# Altium schematic sheet bmsMaster_usb.SchDoc
size A; SheetNumber: 4; SheetTotal: 7
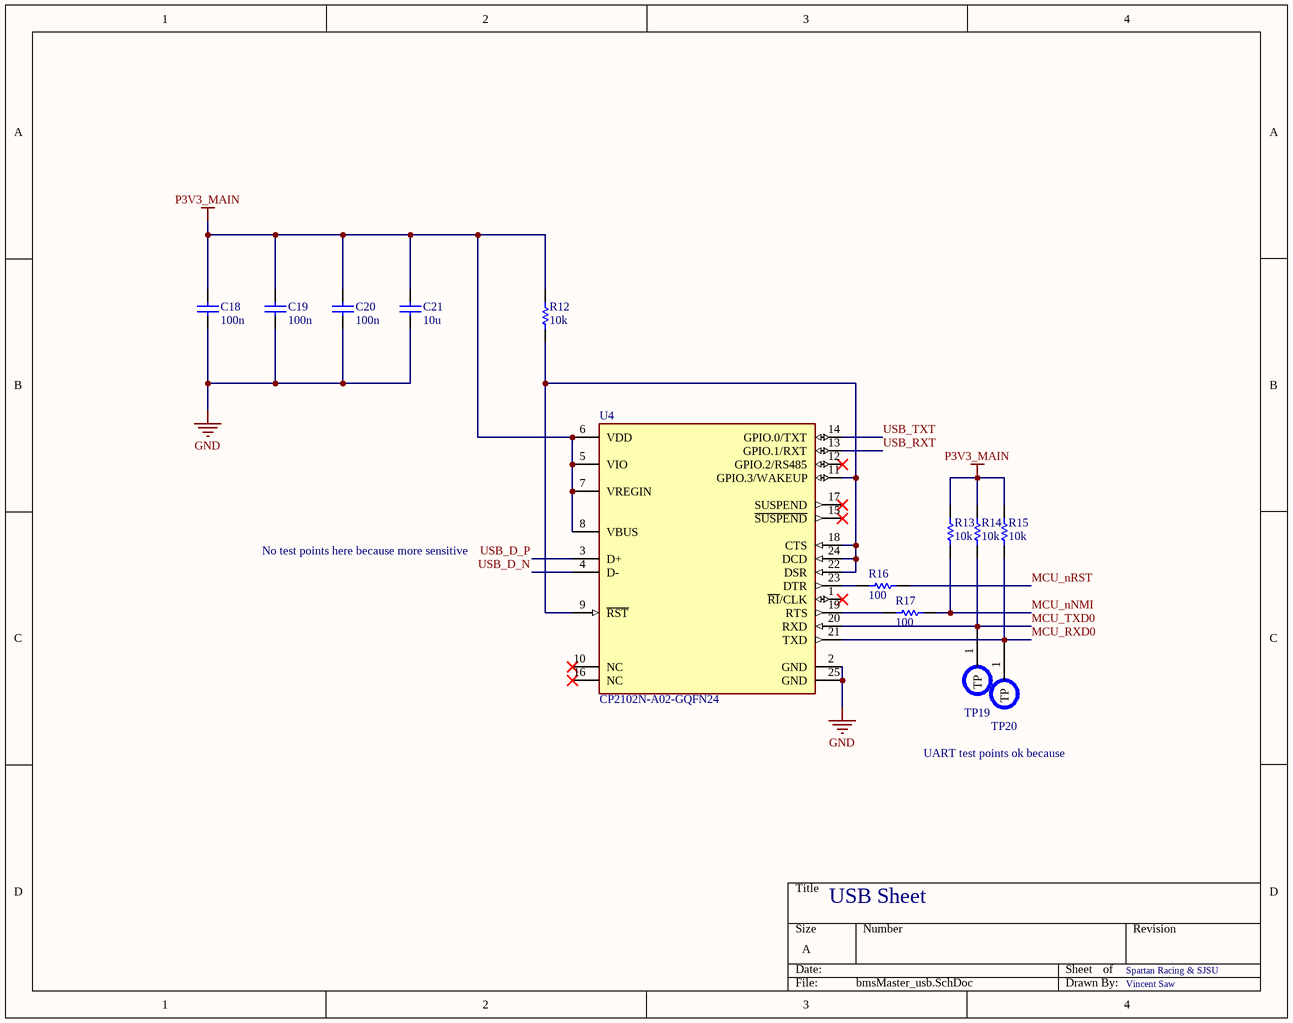
[diagram p0: bmsMaster_usb.SchDoc]

## Parts
C18  value 100n  [CAPC1608X90N]  (hidden comment: Capacitor)
C19  value 100n  [CAPC1608X90N]  (hidden comment: Capacitor)
C20  value 100n  [CAPC1608X90N]  (hidden comment: Capacitor)
C21  value 10u  [CAPC1608X90N]  (hidden comment: Capacitor)
R12  value 10k  [RESC1608X50N]  (hidden comment: Resistor)
R13  value 10k  [RESC1608X50N]  (hidden comment: Resistor)
R14  value 10k  [RESC1608X50N]  (hidden comment: Resistor)
R15  value 10k  [RESC1608X50N]  (hidden comment: Resistor)
R16  value 100  [RESC1608X50N]  (hidden comment: Resistor)
R17  value 100  [RESC1608X50N]  (hidden comment: Resistor)
TP19  TSTPT  [Testpoint1]  (value not drawn)  (no BOM)
TP20  TSTPT  [Testpoint1]  (value not drawn)  (no BOM)
U4  CP2102N-A02-GQFN24  [FP-CP2102N-A02-GQFN24-MFG]

## Nets
GND: C18.1 C19.1 C20.1 C21.1 U4.2(GND) U4.25(GND)
P3V3_MAIN: C18.2 C19.2 C20.2 C21.2 R12.2 R13.2 R14.2 R15.2 U4.5(VIO) U4.6(VDD) U4.7(VREGIN) U4.8(VBUS)
MCU_nNMI: R13.1 R17.1
MCU_nRST: R16.1
MCU_RXD0: R15.1 TP20.1(TP) U4.21(TXD)
MCU_TXD0: R14.1 TP19.1(TP) U4.20(RXD)
USB_D_N: U4.4(D-)
USB_D_P: U4.3(D+)
USB_RXT: U4.13(GPIO.1/RXT)
USB_TXT: U4.14(GPIO.0/TXT)
NetR12_1: R12.1 U4.9(~{RST}) U4.11(GPIO.3/WAKEUP) U4.18(CTS) U4.22(DSR) U4.24(DCD)
NetR16_2: R16.2 U4.23(DTR)
NetR17_2: R17.2 U4.19(RTS)

Not connected (* = marked no-connect by the designer): U4 1(~{RI}/CLK)* 10(NC)* 12(GPIO.2/RS485)* 15(~{SUSPEND})* 16(NC)* 17(SUSPEND)*

## Notes on the sheet
- No test points here because more sensitive
- UART test points ok because
- USB Sheet
- Spartan Racing & SJSU
- Vincent Saw

## Library data of the parts
C18-C21 = Capacitor: SimulationGenericComponent: True
R12-R17 = Resistor: TC1: 0; SimulationGenericComponent: True; TC2: 0
TP19 TP20 = Testpoint1
U4 = CMP-08107-000010-1: IC USB TO UART BRIDGE QFN24